# EAGLE design gateDriverProto (EAGLE 7.7.0)
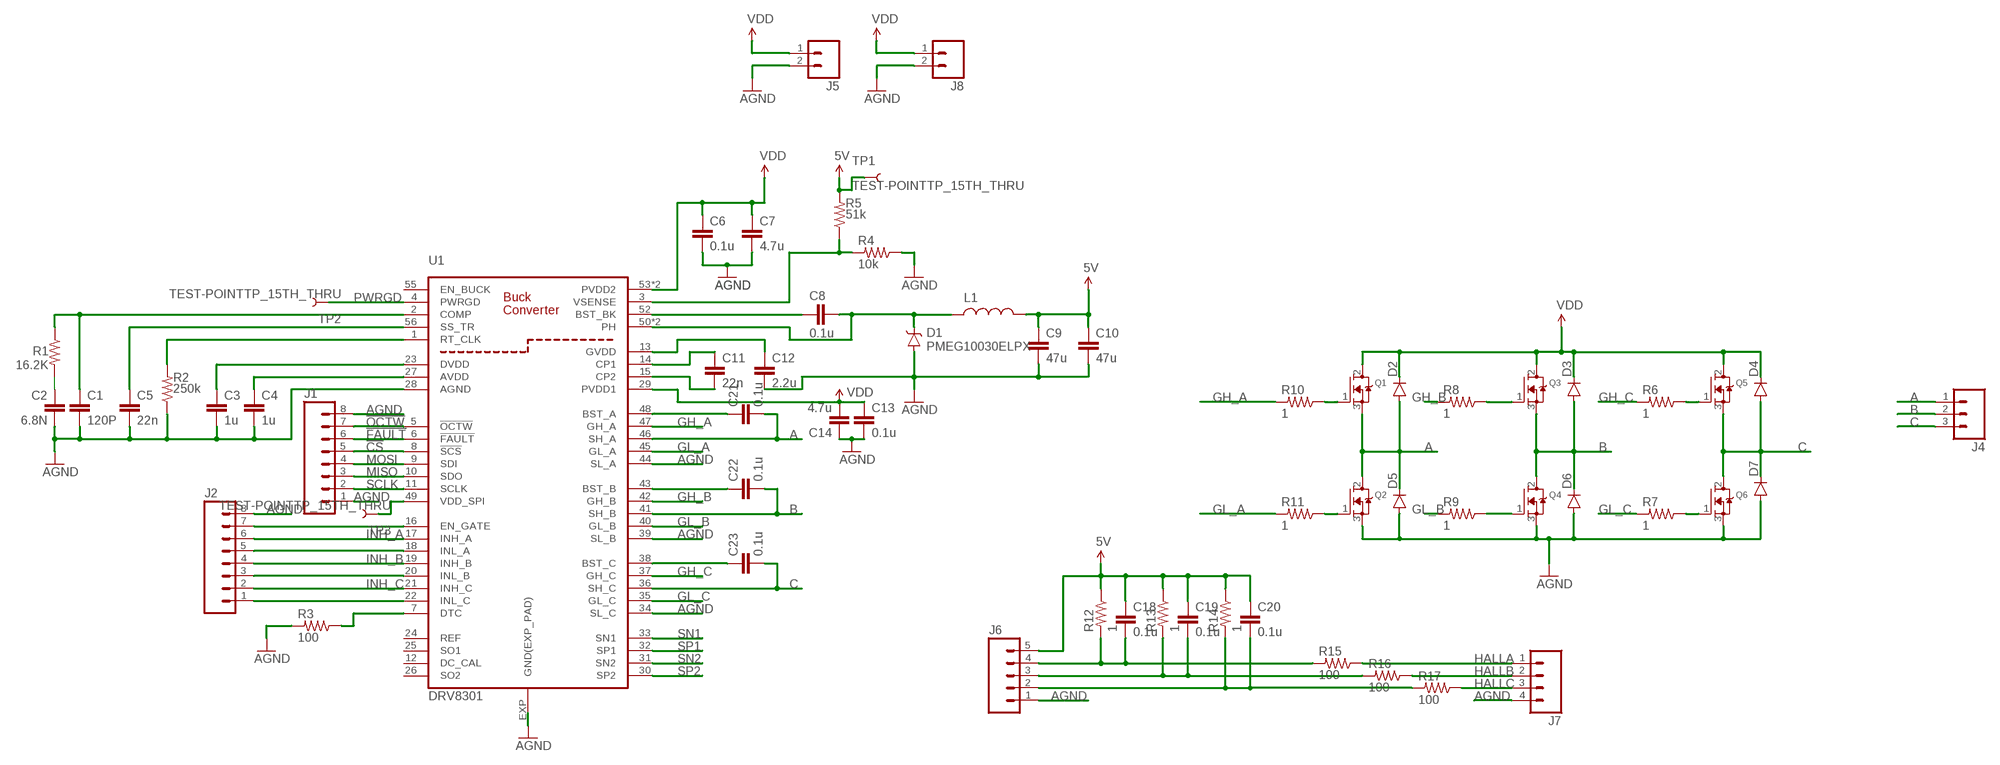
[diagram p0: schematic, sheet 1]

## Parts
C1  120P  CAP0805  [0805]
C2  6.8N  CAP0805  [0805]
C3  1u  CAP0805  [0805]
C4  1u  CAP0805  [0805]
C5  22n  CAP0805  [0805]
C6  0.1u  CAP0805  [0805]
C7  4.7u  CAP1210  [1210]
C8  0.1u  CAP0805  [0805]
C9  47u  CAP1210  [1210]
C10  47u  CAP1210  [1210]
C11  22n  CAP0805  [0805]
C12  2.2u  CAP1210  [1210]
C13  0.1u  CAP0805  [0805]
C14  4.7u  CAP1210  [1210]
C18  0.1u  CAP0805  [0805]
C19  0.1u  CAP0805  [0805]
C20  0.1u  CAP0805  [0805]
C21  0.1u  CAPPTH  [CAP-PTH-SMALL]
C22  0.1u  CAPPTH  [CAP-PTH-SMALL]
C23  0.1u  CAPPTH  [CAP-PTH-SMALL]
D1  PMEG10030ELPX  [SMB-DIODE]
D2  DIODEPTH  [DIODE-1N4001]
D3  DIODEPTH  [DIODE-1N4001]
D4  DIODEPTH  [DIODE-1N4001]
D5  DIODEPTH  [DIODE-1N4001]
D6  DIODEPTH  [DIODE-1N4001]
D7  DIODEPTH  [DIODE-1N4001]
J1  M08  [1X08_ROUND]
J2  M08  [1X08_ROUND]
J4  M03LONGPADS  [1X03_LONGPADS]
J5  M02LOCK_LONGPADS  [1X02_LOCK_LONGPADS]
J6  M05PTH_LONGPADS  [1X05_LONGPADS]
J7  M04PTH  [1X04]
J8  M02LOCK_LONGPADS  [1X02_LOCK_LONGPADS]
L1  INDUCTORPWR  [CDRH125]
Q1  MOSFET-NGDS_TO220V  [TO220V]
Q2  MOSFET-NGDS_TO220V  [TO220V]
Q3  MOSFET-NGDS_TO220V  [TO220V]
Q4  MOSFET-NGDS_TO220V  [TO220V]
Q5  MOSFET-NGDS_TO220V  [TO220V]
Q6  MOSFET-NGDS_TO220V  [TO220V]
R1  16.2K  RESISTORPTH-1/4W-VERT  [AXIAL-0.1]
R2  250k  RESISTORPTH-1/4W-VERT  [AXIAL-0.1]
R3  100  RESISTORPTH-1/4W-VERT  [AXIAL-0.1]
R4  10k  RESISTORPTH-1/4W-VERT  [AXIAL-0.1]
R5  51k  RESISTORPTH-1/4W-VERT  [AXIAL-0.1]
R6  1  RESISTORPTH-1/4W-VERT  [AXIAL-0.1]
R7  1  RESISTORPTH-1/4W-VERT  [AXIAL-0.1]
R8  1  RESISTORPTH-1/4W-VERT  [AXIAL-0.1]
R9  1  RESISTORPTH-1/4W-VERT  [AXIAL-0.1]
R10  1  RESISTORPTH-1/4W-VERT  [AXIAL-0.1]
R11  1  RESISTORPTH-1/4W-VERT  [AXIAL-0.1]
R12  1  RESISTORPTH-1/4W-VERT  [AXIAL-0.1]
R13  1  RESISTORPTH-1/4W-VERT  [AXIAL-0.1]
R14  1  RESISTORPTH-1/4W-VERT  [AXIAL-0.1]
R15  100  RESISTORPTH-1/4W-VERT  [AXIAL-0.1]
R16  100  RESISTORPTH-1/4W-VERT  [AXIAL-0.1]
R17  100  RESISTORPTH-1/4W-VERT  [AXIAL-0.1]
TP1  TEST-POINTTP_15TH_THRU  [TP_15TH]
TP2  TEST-POINTTP_15TH_THRU  [TP_15TH]
TP3  TEST-POINTTP_15TH_THRU  [TP_15TH]
U1  DRV8301  [HTSSOP_56]

## Nets
5V: C9.1 C10.1 C18.1 C19.1 C20.1 J6.5 L1.2 R5.P$2 R12.P$1 R13.P$1 R14.P$1 TP1.P$1
!CS: J1.5 U1.8(!SCS)
!FAULT: J1.6 U1.6(!FAULT)
!OCTW: J1.7 U1.5(!OCTW)
A: C21.2 D2.A D5.C J4.1 Q1.3(S) Q2.2(D) U1.46(SH_A)
AGND: C1.2 C2.2 C3.2 C4.2 C5.2 C6.2 C7.2 C9.2 C10.2 C12.2 C13.2 C14.1 D1.A D5.A D6.A D7.A J1.1 J1.8 J2.8 J5.2 J6.1 J7.4 J8.2 Q2.3(S) Q4.3(S) Q6.3(S) R2.P$1 R3.P$2 R4.P$1 U1.28(AGND) U1.34(SL_C) U1.39(SL_B) U1.44(SL_A) U1.EXP(GND(EXP_PAD))
B: C22.2 D3.A D6.C J4.2 Q3.3(S) Q4.2(D) U1.41(SH_B)
C: C23.2 D4.A D7.C J4.3 Q5.3(S) Q6.2(D) U1.36(SH_C)
GH_A: R10.P$2 U1.47(GH_A)
GH_B: R8.P$2 U1.42(GH_B)
GH_C: R6.P$2 U1.37(GH_C)
GL_A: R11.P$2 U1.45(GL_A)
GL_B: R9.P$2 U1.40(GL_B)
GL_C: R7.P$2 U1.35(GL_C)
HALLA: J7.1 R15.P$1
HALLB: J7.2 R16.P$1
HALLC: J7.3 R17.P$1
INH_A: J2.6 U1.17(INH_A)
INH_B: J2.4 U1.19(INH_B)
INH_C: J2.2 U1.21(INH_C)
MISO: J1.3 U1.10(SDO)
MOSI: J1.4 U1.9(SDI)
N$1: R2.P$2 U1.1(RT_CLK)
N$2: C2.1 R1.P$2
N$3: C5.1 U1.56(SS_TR)
N$4: J2.7 U1.16(EN_GATE)
N$5: C3.1 U1.23(DVDD)
N$6: C1.1 R1.P$1 U1.2(COMP)
N$7: C4.1 U1.27(AVDD)
N$8: R3.P$1 U1.7(DTC)
N$9: R4.P$2 R5.P$1 U1.3(VSENSE)
N$10: C8.1 U1.52(BST_BK)
N$11: C8.2 D1.C L1.1 U1.50(PH) U1.51(PH)
N$12: C12.1 U1.13(GVDD)
N$13: C22.1 U1.43(BST_B)
N$14: C21.1 U1.48(BST_A)
N$15: C18.2 J6.4 R12.P$2 R15.P$2
N$16: C11.2 U1.15(CP2)
N$17: C11.1 U1.14(CP1)
N$18: TP3.P$1 U1.49(VDD_SPI)
N$19: C19.2 J6.3 R13.P$2 R16.P$2
N$20: C23.1 U1.38(BST_C)
N$21: C20.2 J6.2 R14.P$2 R17.P$2
N$22: Q5.1(G) R6.P$1
N$23: J2.5 U1.18(INL_A)
N$24: Q6.1(G) R7.P$1
N$25: J2.1 U1.22(INL_C)
N$26: Q3.1(G) R8.P$1
N$27: Q4.1(G) R9.P$1
N$28: Q2.1(G) R11.P$1
N$29: Q1.1(G) R10.P$1
N$30: J2.3 U1.20(INL_B)
PWRGD: TP2.P$1 U1.4(PWRGD)
SCLK: J1.2 U1.11(SCLK)
SN1: U1.33(SN1)
SN2: U1.31(SN2)
SP1: U1.32(SP1)
SP2: U1.30(SP2)
VDD: C6.1 C7.1 C13.1 C14.2 D2.C D3.C D4.C J5.1 J8.1 Q1.2(D) Q3.2(D) Q5.2(D) U1.29(PVDD1) U1.53(PVDD2) U1.54(PVDD2)
Unconnected: U1.12(DC_CAL) U1.24(REF) U1.25(SO1) U1.26(SO2) U1.55(EN_BUCK)

## Library data of the parts
C1-C14 C18-C20 = SparkFun-Capacitors:CAP: Capacitor Standard 0603 ceramic capacitor, and 0.1" leaded capacitor.
C21-C23 = SparkFun-Passives:CAP: Capacitor Standard 0603 ceramic capacitor, and 0.1" leaded capacitor.
D1 = SparkFun-DiscreteSemi:PMEG10030ELPX
D2-D7 = SparkFun-DiscreteSemi:DIODE: Diode These are standard reverse protection diodes and small signal diodes. SMA package can handle up to about 1A. SOD-323 can handle about 200mA. What the SOD-323 package when ordering, there are some mfgs out there that are 5-pin packages.
J1 J2 = SparkFun-Connectors:M08: Header 8 Standard 8-pin 0.1" header. Use with straight break away headers (SKU : PRT-00116), right angle break away headers (PRT-00553), swiss pins (PRT-00743), machine pins (PRT-00117), and female headers (PRT-00115).; PROD_ID: CONN-08437
J4 = SparkFun-Connectors:M03: Header 3 Standard 3-pin 0.1" header. Use with straight break away headers (SKU : PRT-00116), right angle break away headers (PRT-00553), swiss pins (PRT-00743), machine pins (PRT-00117), and female headers (PRT-00115). Molex polarized connector foot print use with SKU : PRT-08232 with associated crimp pins and housings.
J5 J8 = SparkFun-Connectors:M02: Standard 2-pin 0.1" header. Use with - straight break away headers ( PRT-00116) - right angle break away headers (PRT-00553) - swiss pins (PRT-00743) - machine pins (PRT-00117) - female headers (PRT-00115) Molex polarized connector foot print use with: PRT-08233 with associated crimp pins and housings. 2.54_SCREWTERM for use with PRT-10571. 3.5mm Screw Terminal footprints for PRT-08084 5mm Screw Terminal footprints for use with PRT-08432
J6 = SparkFun-Connectors:M05: Header 5 Standard 5-pin 0.1" header. Use with straight break away headers (SKU : PRT-00116), right angle break away headers (PRT-00553), swiss pins (PRT-00743), machine pins (PRT-00117), and female headers (PRT-00115). Molex polarized connector foot print use with SKU : PRT-08230 with associated crimp pins and housings.
J7 = SparkFun-Connectors:M04: Header 4 Standard 4-pin 0.1" header. Use with straight break away headers (SKU : PRT-00116), right angle break away headers (PRT-00553), swiss pins (PRT-00743), machine pins (PRT-00117), and female headers (PRT-00115). Molex polarized connector foot print use with SKU : PRT-08231 with associated crimp pins and housings. 1MM SMD Version SKU: PRT-10208; PROD_ID: CONN-09696
L1 = SparkFun-Passives:INDUCTOR: Inductors Basic Inductor/Choke - 0603 and 1206. Footprints are not proven and vary greatly between part numbers. INDUCTOR POWER 3.3UH 4.0A SMD 0.197" L x 0.197" W x 0.177" H (5.00mm x 5.00mm x 4.50mm)
Q1-Q6 = adafruit:MOSFET-N: N-Channel Mosfet 2N7002E - 60V 260mA SOT23 [Digikey: 2N7002ET1GOSTR-ND] - REEL BSH103 - 30V 850mA SOT23 [Digikey: 568-5013-1-ND]
R1-R17 = SparkFun-Resistors:RESISTOR: Resistor Basic schematic elements and footprints for 0603, 1206, and PTH resistors.
TP1-TP3 = SparkFun-Passives:TEST-POINT: Bare copper test points for troubleshooting or ICT
U1 = IC:DRV8301: The DRV8301 is a gate driver IC for three-phase motor drive applications. The device provides three half-bridge drivers, each capable of driving two Nchannel MOSFETs. The DRV8301 supports up to 1.7-A source and 2.3-A peak current capability. The DRV8301 can operate off of a single power supply with a wide range from 6-V to 60-V. The device uses a bootstrap gate driver architecture with trickle charge circuitry to support 100% duty cycle. The DRV8301 uses automatic handshaking when the high-side or low-side MOSFET is switching to prevent flow of current. Integrated VDS sensing of the high-side and low-side MOSFETs is used to protect the external power stage against overcurrent conditions. The DRV8301 includes two current shunt amplifiers for accurate current measurement. The amplifiers support bidirectional current sensing and provide an adjustable output offset up to 3 V. The DRV8301 also includes an integrated switching mode buck converter with adjustable output and switching frequency. The buck converter can provide up to 1.5 A to support MCU or additional system power needs. The SPI provides detailed fault reporting and flexible parameter settings such as gain options for the current shunt amplifiers and slew rate control of the gate drivers. Note: An automotive version exsists

## Board
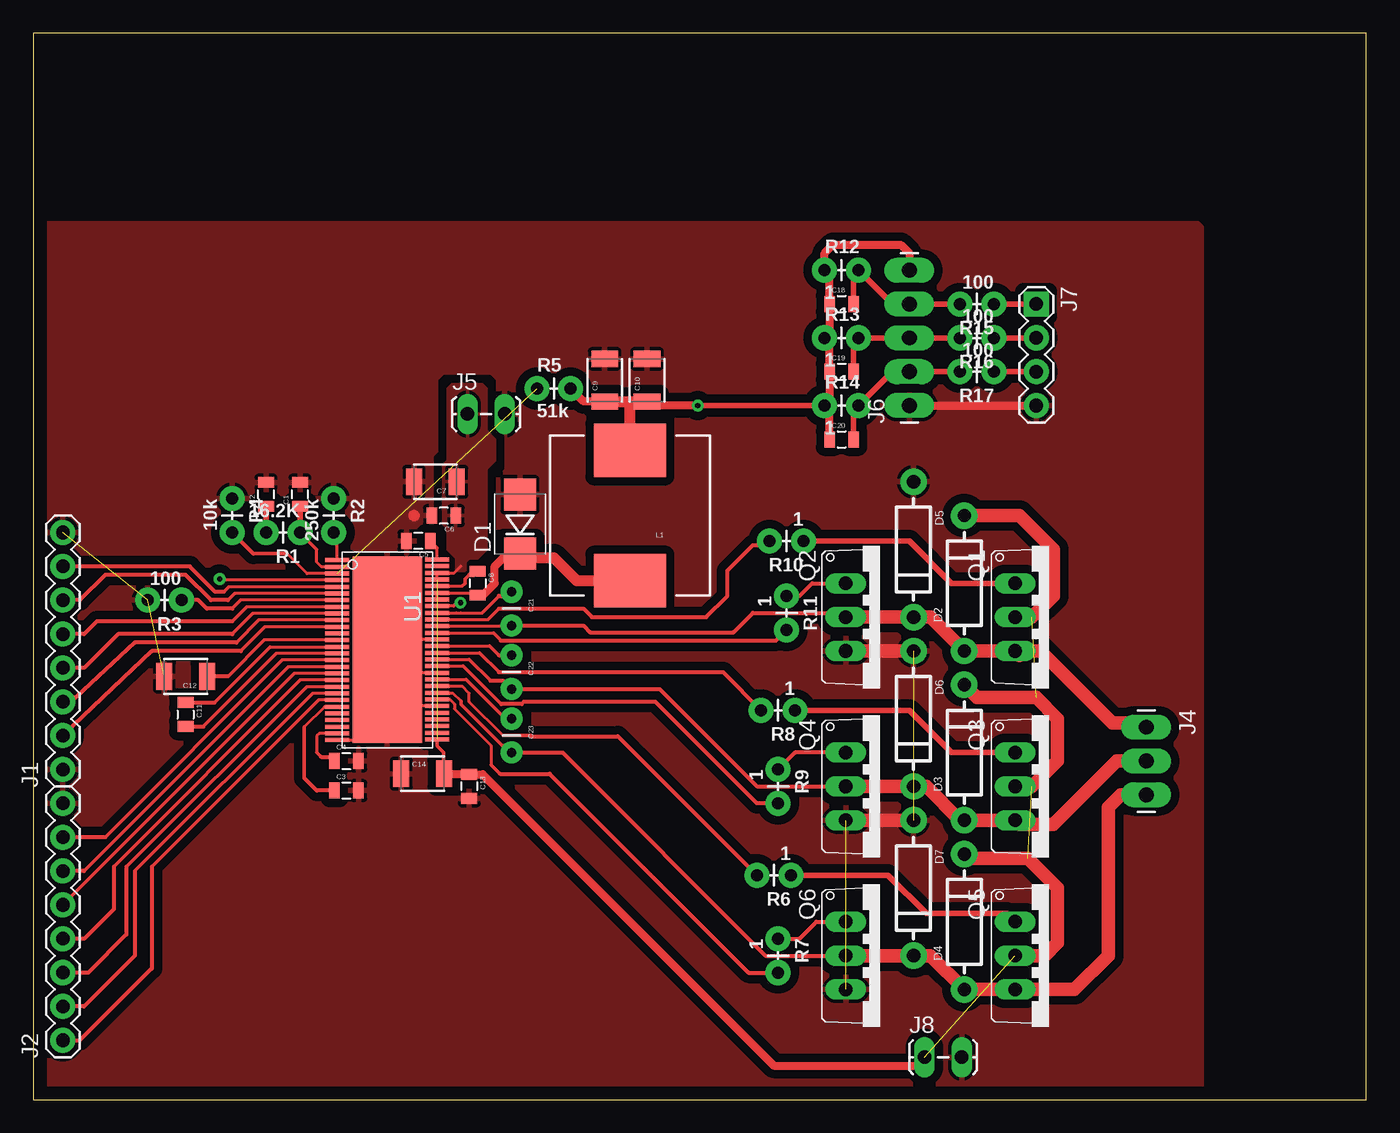
[diagram p1: board, top side]

Size 100 x 80 mm. Coordinates in mm from the lower left corner, seen from the top.
Outline: 0,0 100,0 100,80 0,80 0,0
Copper layers 1: Top 0.035mm
Design rules "default *": minimum track width 10mil, minimum drill 0.6mm, track to track 8mil, track to pad 8mil, pad to pad 8mil, via to via 8mil, smd to smd 8mil, copper to edge 40mil, drill to drill 8mil, minimum pad ring 10mil, minimum via ring 8mil, stop-mask expansion 4mil, vias tented up to drill 0mil, thermal gap 10mil

### Footprints (pad centres in the part's own frame; a part is rotated, then mirrored left to right if it is on the bottom)
0805 = smd 0.8 x 1.2: 1 -0.9,0; 2 0.9,0
1210 = smd 1.2 x 2: 1 -1.6,0; 2 1.6,0
CAP-PTH-SMALL = drill 0.7 pad 1.651: 1 0,0; 2 2.54,0
SMB-DIODE = smd 2.4 x 2.4: A 2.2,0; C -2.2,0
DIODE-1N4001 = drill 1 pad 1.981: A -5.08,0; C 5.08,0
1X08_ROUND = drill 1.016 pad 1.88: 1 0,0; 2 2.54,0; 3 5.08,0; 4 7.62,0; 5 10.16,0; 6 12.7,0; 7 15.24,0; 8 17.78,0
1X03_LONGPADS = drill 1.118 pad 1.88 long: 1 0,0; 2 2.54,0; 3 5.08,0
1X02_LOCK_LONGPADS = drill 1.016 long: 1 -0.127,0; 2 2.667,0
1X05_LONGPADS = drill 1.118 pad 1.88 long: 1 0,0; 2 2.54,0; 3 5.08,0; 4 7.62,0; 5 10.16,0
1X04 = drill 1.016 pad 1.88 square: 1 0,0 | drill 1.016 pad 1.88: 2 2.54,0; 3 5.08,0; 4 7.62,0
CDRH125 = smd 5.4 x 4: 1 0,4.9; 2 0,-4.9
TO220V = drill 1.016 long: 1 -2.54,-2.54; 2 0,-2.54; 3 2.54,-2.54
AXIAL-0.1 = drill 0.9 pad 1.88: P$1 0,0; P$2 2.54,0
TP_15TH = drill 0.381 pad 0.61: P$1 0,0
HTSSOP_56 = smd 0.3 x 1.8: 1 -6.81,-3.545; 2 -6.31,-3.545; 3 -5.81,-3.545; 4 -5.31,-3.545; 5 -4.81,-3.545; 6 -4.31,-3.545; 7 -3.81,-3.545; 8 -3.31,-3.545; 9 -2.81,-3.545; 10 -2.31,-3.545; 11 -1.81,-3.545; 12 -1.31,-3.545; 13 -0.81,-3.545; 14 -0.31,-3.545; 15 0.19,-3.545; 16 0.69,-3.545; 17 1.19,-3.545; 18 1.69,-3.545; 19 2.19,-3.545; 20 2.69,-3.545; 21 3.19,-3.545; 22 3.69,-3.545; 23 4.19,-3.545; 24 4.69,-3.545; 25 5.19,-3.545; 26 5.69,-3.545; 27 6.19,-3.545; 28 6.69,-3.545; 29 6.64,3.955; 30 6.14,3.955; 31 5.64,3.955; 32 5.14,3.955; 33 4.64,3.955; 34 4.14,3.955; 35 3.64,3.955; 36 3.14,3.955; 37 2.64,3.955; 38 2.14,3.955; 39 1.64,3.955; 40 1.14,3.955; 41 0.64,3.955; 42 0.14,3.955; 43 -0.36,3.955; 44 -0.86,3.955; 45 -1.36,3.955; 46 -1.86,3.955; 47 -2.36,3.955; 48 -2.86,3.955; 49 -3.36,3.955; 50 -3.86,3.955; 51 -4.36,3.955; 52 -4.86,3.955; 53 -5.36,3.955; 54 -5.86,3.955; 55 -6.36,3.955; 56 -6.86,3.955 | smd 14 x 5.2: EXP -0.085,0.205

### Placement (x,y rotation side)
C1  20,45.4 90 top
C2  17.46,45.4 90 top
C3  23.5,23.18 0 top
C4  23.5,25.4 0 top
C5  28.89,41.91 180 top
C6  30.8,43.81 180 top
C7  30.16,46.35 180 top
C8  33.34,38.73 270 top
C9  42.86,53.98 90 top
C10  46.04,53.98 90 top
C11  11.43,28.89 270 top
C12  11.43,31.75 180 top
C13  32.7,23.5 270 top
C14  29.21,24.45 0 top
C18  60.64,59.69 0 top
C19  60.64,54.61 0 top
C20  60.64,49.53 0 top
C21  35.88,38.1 270 top
C22  35.88,33.34 270 top
C23  35.88,28.57 270 top
D1  36.51,43.18 90 top
D2  69.85,38.73 90 top
D3  69.85,26.04 90 top
D4  69.85,13.34 90 top
D5  66.04,41.27 270 top
D6  66.04,28.57 270 top
D7  66.04,15.88 270 top
J1  2.22,24.77 90 top
J2  2.22,4.45 90 top
J4  83.5,27.94 270 top
J5  32.7,51.44 0 top
J6  65.72,52.07 90 top
J7  75.25,59.69 270 top
J8  66.99,3.17 0 top
L1  44.77,43.81 180 top
Q1  76.2,36.2 270 top
Q2  63.5,36.2 270 top
Q3  76.2,23.5 270 top
Q4  63.5,23.5 270 top
Q5  76.2,10.79 270 top
Q6  63.5,10.79 270 top
R1  20,42.55 180 top
R2  22.54,45.09 270 top
R3  11.11,37.47 180 top
R4  14.92,45.09 270 top
R5  37.78,53.34 0 top
R6  56.83,16.83 180 top
R7  55.88,12.06 270 top
R8  57.15,29.21 180 top
R9  55.88,24.77 270 top
R10  57.78,41.91 180 top
R11  56.52,37.78 270 top
R12  59.37,62.23 0 top
R13  59.37,57.15 0 top
R14  59.37,52.07 0 top
R15  72.07,59.69 180 top
R16  72.07,57.15 180 top
R17  72.07,54.61 180 top
TP1  49.85,52.07 0 top
TP2  13.97,39.05 0 top
TP3  32.04,37.27 0 top
U1  26.35,33.66 270 top

### Tracks (layer width: path | path; a pad name or v marks a point on that pad's centre or on a via)
5V
  Top 0.406: TP1.P$1 R14.P$1
  Top 0.61: C20.1 59.74,51.7 R14.P$1 59.74,52.44 C19.1 59.74,56.78 R13.P$1 59.74,57.52 C18.1 59.74,61.86 R12.P$1 59.37,63.5 60.01,64.14 65.09,64.14 65.72,63.5 J6.5 | TP1.P$1 46.34,52.07 C10.1 | C9.1 41.29,52.38 R5.P$2
  Top 0.813: C9.1 44.77,52.38 | 44.77,52.38 C10.1 | L1.2 44.77,52.38
!CS
  Top 0.241: U1.8 16.01,36.97
  Top 0.267: 16.01,36.97 14.92,35.88
  Top 0.305: 14.92,35.88 4.76,35.88 3.81,34.92 J1.5
!FAULT
  Top 0.241: U1.6 15.11,37.97
  Top 0.267: 15.11,37.97 14.61,37.47
  Top 0.305: 14.61,37.47 13.34,37.47 11.43,39.37 5.4,39.37 3.49,37.47 J1.6
!OCTW
  Top 0.241: U1.5 14.65,38.47
  Top 0.267: 14.65,38.47 14.29,38.1
  Top 0.305: 14.29,38.1 13.65,38.1 11.75,40.01 J1.7
A
  Top 0.241: U1.46 35.83,35.52
  Top 0.305: 35.83,35.52 C21.2 41.27,35.56 41.78,35.05 52.51,35.05 53.98,36.51 60.64,36.51 Q2.2
  Top 1.016: Q2.2 D5.C 67.31,36.2 D2.A Q1.3 | Q1.3 73.98,33.34 | Q1.3 75.56,33.66 80.96,28.26 83.19,28.26 J4.1
AGND  (4 unrouted)
  Top 0.241: U1.44 27.85,34.52 | U1.39 27.25,32.02 | U1.34 27.95,29.52 | U1.28 25.06,26.96
  Top 0.254: 27.85,34.52 27.62,34.29 | 27.25,32.02 26.99,31.75 | 27.95,29.52 27.62,29.84
  Top 0.305: 27.99,39.74 27.62,39.37 27.62,36.2 27.62,34.29 27.11,34.29 U1.EXP 26.56,32.71 27.25,32.02 | 26.99,31.75 26.99,30.48 27.46,30 | 27.46,30 27.62,29.84 | 25.06,26.96 25.08,26.99 25.08,27.62 27.46,30
  Top 0.61: J6.1 J7.4 | 25.08,38.73 27.62,36.2
  Top 0.813: 28.57,46.37 C7.2 | 28.57,43.81 28.56,43.83 28.56,43.8
  Top 1.016: D6.A Q2.3 | D7.A Q4.3
  pour Top (isolate 0.635, rank 2): 0.32,62.55 0.32,0 87.63,0 87.63,65.41 87.31,65.72 0,65.72 0,62.87
B
  Top 0.241: U1.41 32.71,33.02
  Top 0.267: 32.71,33.02 34.29,31.43
  Top 0.305: 34.29,31.43 35.24,31.43 C22.2 46.99,30.8 54.29,23.5 Q4.2
  Top 1.016: J4.2 81.28,25.4 76.52,20.64 73.98,20.64 Q3.3 D3.A 69.53,20.95 66.99,23.5 D6.C Q4.2
C
  Top 0.241: 30.32,30.5 31.47,30.5 32.08,29.9
  Top 0.267: 32.08,29.9 32.08,29.64 35.69,26.04
  Top 0.305: 35.37,26.54 C23.2 | U1.36 30.32,30.5 | 35.69,26.04 C23.2 | Q6.2 54.93,10.79 39.69,26.04 C23.2
  Top 1.016: Q6.2 D7.C 67.31,10.79 D4.A Q5.3 78.11,8.26 80.64,10.79 80.64,21.91 81.6,22.86 J4.3
GH_A
  Top 0.241: U1.47 34.11,36.02
  Top 0.267: 34.11,36.02 34.92,36.83
  Top 0.305: 34.92,36.83 41.27,36.83 41.91,36.2 50.48,36.2 52.07,37.78 52.07,39.69 53.98,41.59 54.93,41.59 R10.P$2
GH_B
  Top 0.241: U1.42 33.48,33.52
  Top 0.267: 33.48,33.52 34.92,32.07
  Top 0.305: 34.92,32.07 51.75,32.07 R8.P$2
GH_C
  Top 0.241: U1.37 32.17,31.02 32.7,30.48 32.7,29.84 35.24,27.3
  Top 0.267: 35.24,27.3 37.33,27.3
  Top 0.305: 37.33,27.3 37.38,27.25 43.87,27.25 R6.P$2
GL_A
  Top 0.241: U1.45 34.52,35.02
  Top 0.267: 34.52,35.02 35.09,34.44
  Top 0.305: 35.09,34.44 55.72,34.44 R11.P$2
GL_B
  Top 0.241: U1.40 32.26,32.52
  Top 0.267: 32.26,32.52 35.1,29.67
  Top 0.305: R9.P$2 54.29,22.23 46.67,29.84 36.82,29.84 36.64,29.67 35.1,29.67
GL_C
  Top 0.241: 34.34,25.12 34.34,26.57 31.6,29.31 31.6,29.68 31.26,30.02 U1.35
  Top 0.267: 34.34,25.12 35.01,24.45
  Top 0.305: 35.01,24.45 38.73,24.45 53.66,9.53 R7.P$2
HALLA
  Top 0.406: R15.P$1 J7.1
HALLB
  Top 0.406: J7.2 R16.P$1
HALLC
  Top 0.406: J7.3 R17.P$1
INH_A
  Top 0.241: U1.17 19.13,32.47
  Top 0.267: 19.13,32.47 3.81,17.14
  Top 0.305: 3.81,17.14 J2.6
INH_B
  Top 0.241: U1.19 20.04,31.46
  Top 0.267: 20.04,31.46 6.03,17.46
  Top 0.305: 6.03,17.46 6.03,14.29 3.81,12.06 J2.4
INH_C
  Top 0.241: U1.21 20.94,30.46
  Top 0.267: 20.94,30.46 7.62,17.14
  Top 0.305: 7.62,17.14 7.62,10.79 3.81,6.99 J2.2
MISO
  Top 0.241: U1.10 16.91,35.97
  Top 0.267: 16.91,35.97 15.24,34.29
  Top 0.305: 15.24,34.29 7.62,34.29 3.17,30.16 2.54,30.16 J1.3
MOSI
  Top 0.241: U1.9 16.46,36.47
  Top 0.267: 16.46,36.47 14.92,34.92
  Top 0.305: 14.92,34.92 6.35,34.92 3.81,32.38 J1.4
N$1
  Top 0.241: U1.1 22.81,42.28
  Top 0.305: 22.81,42.28 R2.P$2
N$2
  Top 0.406: R1.P$2 C2.1
N$3
  Top 0.241: U1.56 30.31,41.4
  Top 0.267: 30.31,41.4 C5.1
N$4
  Top 0.241: U1.16 18.68,32.97
  Top 0.267: 18.68,32.97 5.4,19.68
  Top 0.305: 5.4,19.68 J2.7
N$5
  Top 0.241: U1.23 21.84,29.46 20.32,27.94
  Top 0.267: 20.32,27.94 20.32,24.13
  Top 0.305: C3.1 21.27,23.18 20.32,24.13
N$6
  Top 0.241: U1.2 21.63,39.97 21.27,40.32 21.27,41.27
  Top 0.267: 21.27,41.27 R1.P$1
  Top 0.406: R1.P$1 C1.1
N$7
  Top 0.241: U1.27 21.43,27.46 21.27,27.3 21.27,26.04
  Top 0.267: 21.27,26.04 21.59,25.72
  Top 0.305: 21.59,25.72 22.28,25.72 C4.1
N$8
  Top 0.241: U1.7 15.56,37.47
  Top 0.267: 15.56,37.47 14.92,36.83
  Top 0.305: 14.92,36.83 13.02,36.83 12.38,37.47 R3.P$1
N$9  (1 unrouted)
  Top 0.241: U1.3 20.54,39.47 19.05,40.96
  Top 0.267: 19.05,40.96 16.51,40.96
  Top 0.305: 16.51,40.96 R4.P$2
N$10
  Top 0.241: U1.52 32.16,38.52
  Top 0.267: 32.16,38.52 32.38,38.73 32.38,39.05 32.7,39.37
  Top 0.305: 32.7,39.37 33.07,39.37 C8.1
N$11
  Top 0.241: 33.16,38.02 U1.51 U1.50
  Top 0.305: 33.16,38.02 C8.2
  Top 0.61: C8.2 33.71,37.84 34.61,38.73 34.61,40.01 35.24,40.64 36.17,40.64 D1.C
  Top 0.813: L1.1 40.78,38.91 39.05,40.64 36.85,40.64 D1.C
N$12
  Top 0.241: U1.13 17.32,34.47
  Top 0.267: 17.32,34.47 14.61,31.75
  Top 0.305: 14.61,31.75 C12.1
N$13
  Top 0.241: U1.43 34.25,34.02
  Top 0.267: 34.25,34.02 34.92,33.34
  Top 0.305: 34.92,33.34 C22.1
N$14
  Top 0.241: U1.48 31.75,36.52 32.07,36.51 33.66,36.51
  Top 0.267: 33.66,36.51 34.92,37.78
  Top 0.305: 34.92,37.78 35.56,37.78 C21.1
N$15
  Top 0.406: R15.P$2 J6.4 64.45,59.69 R12.P$2 61.54,61.86 C18.2
N$16
  Top 0.241: U1.15 18.23,33.47
  Top 0.267: 12.75,27.99 18.23,33.47
  Top 0.305: C11.2 12.75,27.99
N$17
  Top 0.241: 17.78,33.97 U1.14
  Top 0.267: 13.6,29.79 17.78,33.97
  Top 0.305: C11.1 13.6,29.79 | U1.14
N$18
  Top 0.241: 31.52,37.03 30.33,37.03
  Top 0.254: TP3.P$1 31.76,37.27 31.52,37.03 | 30.33,37.03 U1.49
N$19
  Top 0.406: R16.P$2 J6.3 R13.P$2 61.54,56.78 C19.2
N$20
  Top 0.241: U1.38 32.47,31.52
  Top 0.267: 32.47,31.52 35.2,28.78
  Top 0.305: 35.2,28.78 35.67,28.78 C23.1
N$21
  Top 0.406: R17.P$2 J6.2 64.45,54.61 R14.P$2 61.54,51.7 C20.2
N$22
  Top 0.406: R6.P$1 64.14,16.83 66.99,13.97 73.03,13.97 Q5.1
N$23
  Top 0.178: U1.18 21.89,31.96
  Top 0.241: 21.89,31.96 19.58,31.96
  Top 0.267: 19.58,31.96 J2.5
N$24
  Top 0.305: R7.P$1 57.47,12.06 58.74,13.34 Q6.1
N$25
  Top 0.241: U1.22 21.39,29.96
  Top 0.267: 21.39,29.96 8.89,17.46
  Top 0.305: J2.1 3.49,4.45 8.89,9.84 8.89,17.46
N$26
  Top 0.406: R8.P$1 65.72,29.21 68.9,26.04 Q3.1
N$27
  Top 0.305: Q4.1 57.15,26.04 R9.P$1
N$28
  Top 0.305: R11.P$1 57.47,37.78 58.42,38.73 Q2.1
N$29
  Top 0.406: Q1.1 68.9,38.73 65.72,41.91 R10.P$1
N$30
  Top 0.241: U1.20 20.49,30.96
  Top 0.267: 20.49,30.96 6.99,17.46
  Top 0.305: 6.99,17.46 6.99,12.38 4.13,9.53 J2.3
PWRGD
  Top 0.241: U1.4 14.06,38.97
  Top 0.305: 14.06,38.97 TP2.P$1
SCLK
  Top 0.241: U1.11 17.37,35.47
  Top 0.267: 17.37,35.47 15.56,33.66
  Top 0.305: 15.56,33.66 8.89,33.66 J1.2
VDD  (4 unrouted)
  Top 0.241: 32.07,40.01 31.58,39.52 U1.54 U1.53
  Top 0.267: U1.29 30.31,26.52 30.8,26.04 30.8,24.46
  Top 0.305: 30.8,24.46 C14.2
  Top 0.61: C14.2 32.65,24.45 C13.1 33.71,24.39 55.56,2.54 66.23,2.54 J8.1
  Top 1.016: Q1.2 74.93,36.2 76.52,37.78 76.52,41.27 73.98,43.81 D2.C | Q3.2 74.93,23.5 76.83,25.4 76.83,28.57 75.25,30.16 70.8,30.16 D3.C | Q5.2 75.88,10.79 76.83,11.75 76.83,15.88 74.61,18.1 70.17,18.1 D4.C
  pour Top: 31.75,40.64 31.75,39.69 32.38,39.69 32.38,40.32 32.7,40.64 33.34,40.64 33.97,41.27 33.97,47.31 34.61,47.94 34.61,49.53 33.97,50.16 33.97,53.34 33.66,53.66 31.43,53.66 31.11,53.34 31.11,47.94 30.8,47.62 30.8,43.18 31.11,42.86 31.11,41.27